# EAGLE design zx81_kbd v0.2 (EAGLE 9.6.2)
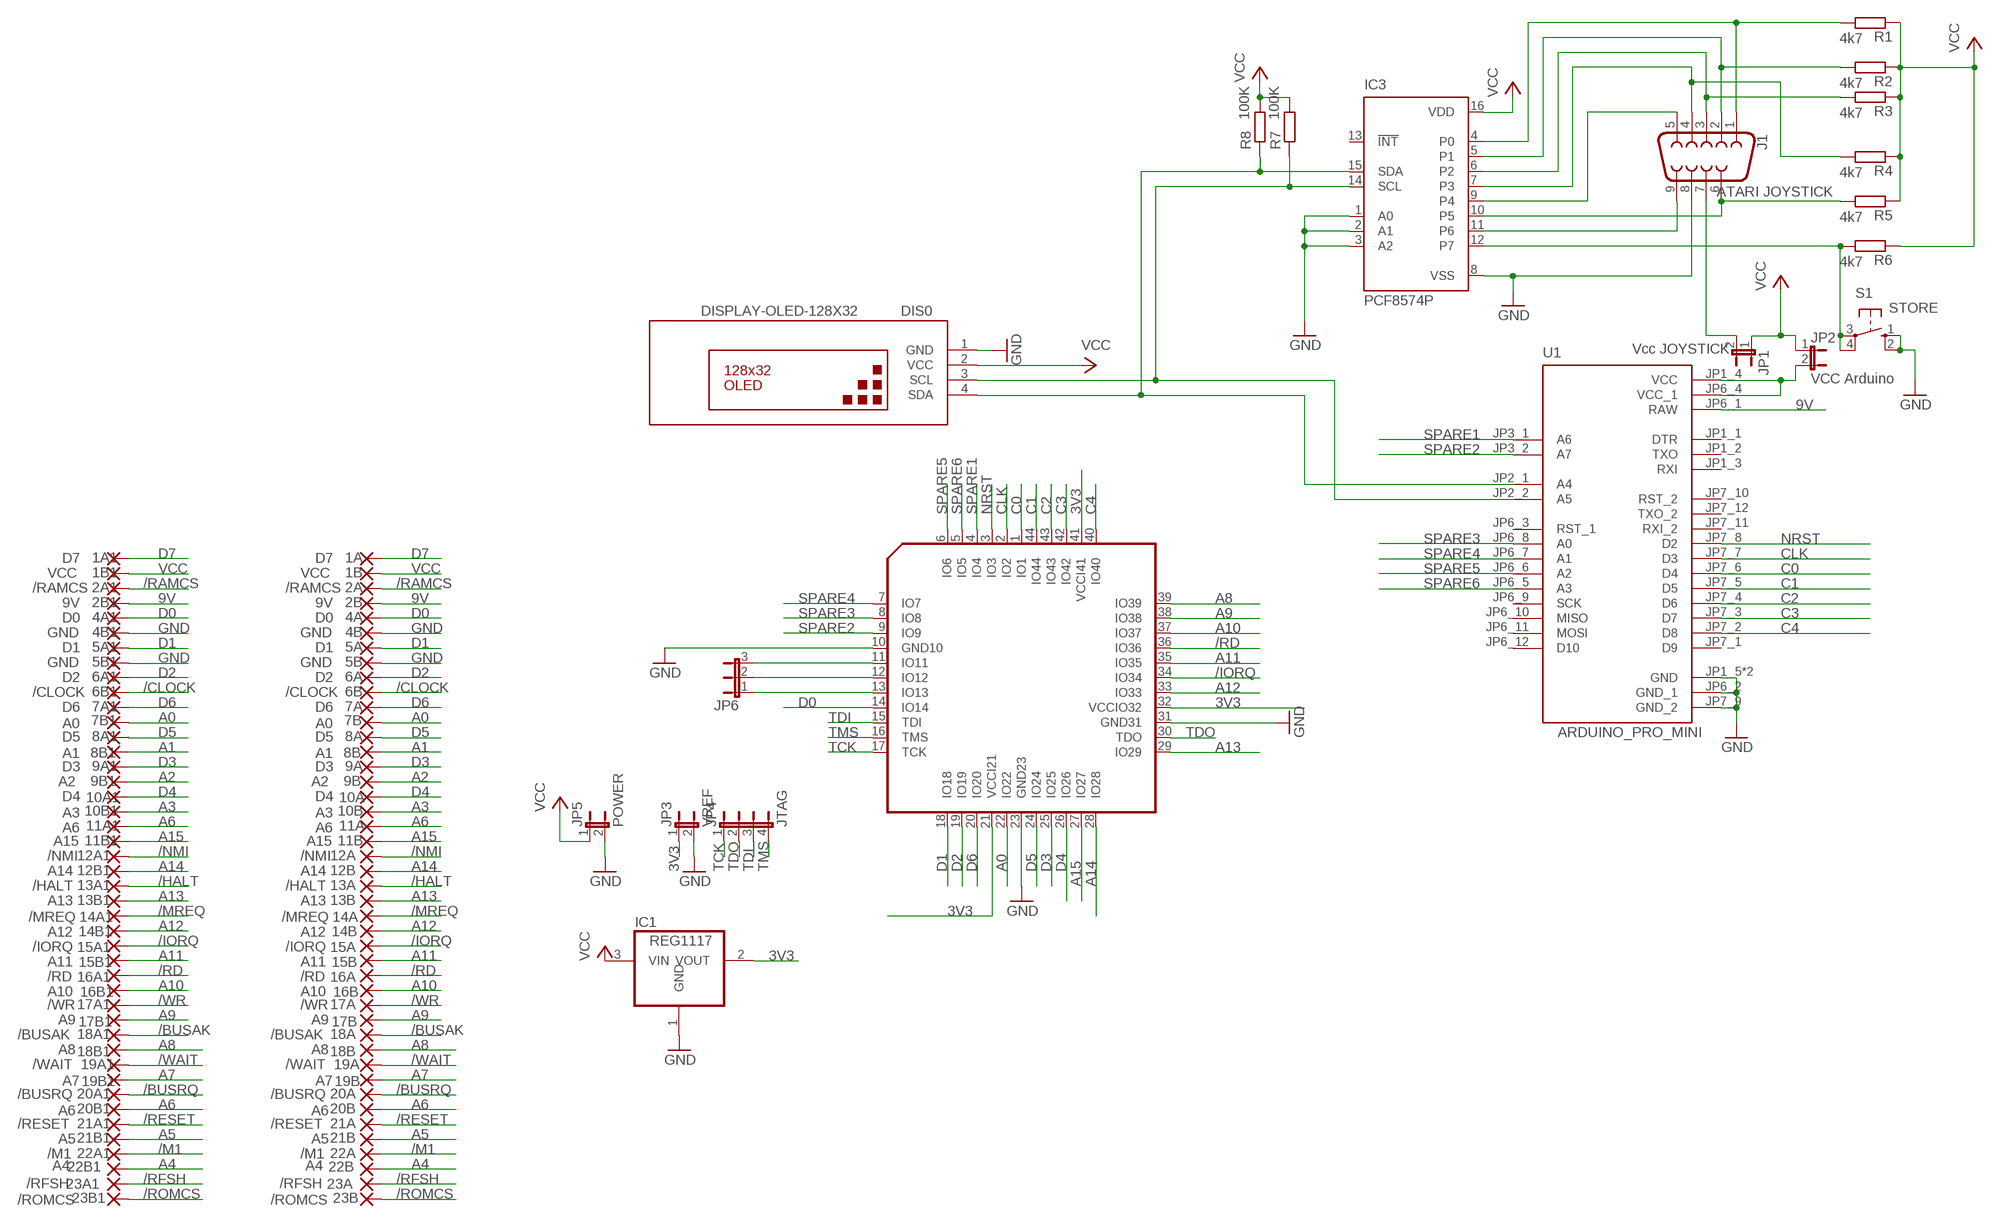
[diagram p0: schematic, sheet 1]

## Parts
1A  D7  SMD2EDGEPIN  [EDGEPIN]
1A1  D7  SMD2EDGEPIN  [EDGEPIN]
1B  VCC  SMD2EDGEPIN  [EDGEPIN]
1B1  VCC  SMD2EDGEPIN  [EDGEPIN]
2A  /RAMCS  SMD2EDGEPIN  [EDGEPIN]
2A1  /RAMCS  SMD2EDGEPIN  [EDGEPIN]
2B  9V  SMD2EDGEPIN  [EDGEPIN]
2B1  9V  SMD2EDGEPIN  [EDGEPIN]
4A  D0  SMD2EDGEPIN  [EDGEPIN]
4A1  D0  SMD2EDGEPIN  [EDGEPIN]
4B  GND  SMD2EDGEPIN  [EDGEPIN]
4B1  GND  SMD2EDGEPIN  [EDGEPIN]
5A  D1  SMD2EDGEPIN  [EDGEPIN]
5A1  D1  SMD2EDGEPIN  [EDGEPIN]
5B  GND  SMD2EDGEPIN  [EDGEPIN]
5B1  GND  SMD2EDGEPIN  [EDGEPIN]
6A  D2  SMD2EDGEPIN  [EDGEPIN]
6A1  D2  SMD2EDGEPIN  [EDGEPIN]
6B  /CLOCK  SMD2EDGEPIN  [EDGEPIN]
6B1  /CLOCK  SMD2EDGEPIN  [EDGEPIN]
7A  D6  SMD2EDGEPIN  [EDGEPIN]
7A1  D6  SMD2EDGEPIN  [EDGEPIN]
7B  A0  SMD2EDGEPIN  [EDGEPIN]
7B1  A0  SMD2EDGEPIN  [EDGEPIN]
8A  D5  SMD2EDGEPIN  [EDGEPIN]
8A1  D5  SMD2EDGEPIN  [EDGEPIN]
8B  A1  SMD2EDGEPIN  [EDGEPIN]
8B1  A1  SMD2EDGEPIN  [EDGEPIN]
9A  D3  SMD2EDGEPIN  [EDGEPIN]
9A1  D3  SMD2EDGEPIN  [EDGEPIN]
9B  A2  SMD2EDGEPIN  [EDGEPIN]
9B1  A2  SMD2EDGEPIN  [EDGEPIN]
10A  D4  SMD2EDGEPIN  [EDGEPIN]
10A1  D4  SMD2EDGEPIN  [EDGEPIN]
10B  A3  SMD2EDGEPIN  [EDGEPIN]
10B1  A3  SMD2EDGEPIN  [EDGEPIN]
11A  A6  SMD2EDGEPIN  [EDGEPIN]
11A1  A6  SMD2EDGEPIN  [EDGEPIN]
11B  A15  SMD2EDGEPIN  [EDGEPIN]
11B1  A15  SMD2EDGEPIN  [EDGEPIN]
12A  /NMI  SMD2EDGEPIN  [EDGEPIN]
12A1  /NMI  SMD2EDGEPIN  [EDGEPIN]
12B  A14  SMD2EDGEPIN  [EDGEPIN]
12B1  A14  SMD2EDGEPIN  [EDGEPIN]
13A  /HALT  SMD2EDGEPIN  [EDGEPIN]
13A1  /HALT  SMD2EDGEPIN  [EDGEPIN]
13B  A13  SMD2EDGEPIN  [EDGEPIN]
13B1  A13  SMD2EDGEPIN  [EDGEPIN]
14A  /MREQ  SMD2EDGEPIN  [EDGEPIN]
14A1  /MREQ  SMD2EDGEPIN  [EDGEPIN]
14B  A12  SMD2EDGEPIN  [EDGEPIN]
14B1  A12  SMD2EDGEPIN  [EDGEPIN]
15A  /IORQ  SMD2EDGEPIN  [EDGEPIN]
15A1  /IORQ  SMD2EDGEPIN  [EDGEPIN]
15B  A11  SMD2EDGEPIN  [EDGEPIN]
15B1  A11  SMD2EDGEPIN  [EDGEPIN]
16A  /RD  SMD2EDGEPIN  [EDGEPIN]
16A1  /RD  SMD2EDGEPIN  [EDGEPIN]
16B  A10  SMD2EDGEPIN  [EDGEPIN]
16B1  A10  SMD2EDGEPIN  [EDGEPIN]
17A  /WR  SMD2EDGEPIN  [EDGEPIN]
17A1  /WR  SMD2EDGEPIN  [EDGEPIN]
17B  A9  SMD2EDGEPIN  [EDGEPIN]
17B1  A9  SMD2EDGEPIN  [EDGEPIN]
18A  /BUSAK  SMD2EDGEPIN  [EDGEPIN]
18A1  /BUSAK  SMD2EDGEPIN  [EDGEPIN]
18B  A8  SMD2EDGEPIN  [EDGEPIN]
18B1  A8  SMD2EDGEPIN  [EDGEPIN]
19A  /WAIT  SMD2EDGEPIN  [EDGEPIN]
19A1  /WAIT  SMD2EDGEPIN  [EDGEPIN]
19B  A7  SMD2EDGEPIN  [EDGEPIN]
19B1  A7  SMD2EDGEPIN  [EDGEPIN]
20A  /BUSRQ  SMD2EDGEPIN  [EDGEPIN]
20A1  /BUSRQ  SMD2EDGEPIN  [EDGEPIN]
20B  A6  SMD2EDGEPIN  [EDGEPIN]
20B1  A6  SMD2EDGEPIN  [EDGEPIN]
21A  /RESET  SMD2EDGEPIN  [EDGEPIN]
21A1  /RESET  SMD2EDGEPIN  [EDGEPIN]
21B  A5  SMD2EDGEPIN  [EDGEPIN]
21B1  A5  SMD2EDGEPIN  [EDGEPIN]
22A  /M1  SMD2EDGEPIN  [EDGEPIN]
22A1  /M1  SMD2EDGEPIN  [EDGEPIN]
22B  A4  SMD2EDGEPIN  [EDGEPIN]
22B1  A4  SMD2EDGEPIN  [EDGEPIN]
23A  /RFSH  SMD2EDGEPIN  [EDGEPIN]
23A1  /RFSH  SMD2EDGEPIN  [EDGEPIN]
23B  /ROMCS  SMD2EDGEPIN  [EDGEPIN]
23B1  /ROMCS  SMD2EDGEPIN  [EDGEPIN]
DIS0  DISPLAY-OLED-128X32  [DISPLAY-OLED-128X32]
IC1  REG1117  [SOT223]
IC3  PCF8574P  [DIL16]
J1  ATARI JOYSTICK  DB9MALE  [DB9_MALE]
JP1  Vcc JOYSTICK  JP1E  [JP1]
JP2  VCC Arduino  JP1E  [JP1]
JP3  VREF  JP1E  [JP1]
JP4  JTAG  JP4E  [JP4]
JP5  POWER  JP1E  [JP1]
JP6  JP2E  [JP2]
R1  4k7  R-EU_0204/7  [0204/7]
R2  4k7  R-EU_0204/7  [0204/7]
R3  4k7  R-EU_0204/7  [0204/7]
R4  4k7  R-EU_0204/7  [0204/7]
R5  4k7  R-EU_0204/7  [0204/7]
R6  4k7  R-EU_0204/7  [0204/7]
R7  100K  R-EU_0204/7  [0204/7]
R8  100K  R-EU_0204/7  [0204/7]
S1  STORE  10-XX11MM  [B3F-10XX_11MM]
U1  ARDUINO_PRO_MINI  [MODULE_ARDUINO_PRO_MINI]
XC95CPLD  XC9572PLC  [3M44]

## Nets
3V3 [VCC]: IC1.2(VOUT) JP3.1 XC95CPLD.21(VCCI21) XC95CPLD.32(VCCIO32) XC95CPLD.41(VCCI41)
9V [VCC]: 2B1.1(P) 2B.1(P) U1.JP6_1(RAW)
/BUSAK: 18A1.1(P) 18A.1(P)
/BUSRQ: 20A1.1(P) 20A.1(P)
/CLOCK: 6B1.1(P) 6B.1(P)
/HALT: 13A1.1(P) 13A.1(P)
/IORQ: 15A1.1(P) 15A.1(P) XC95CPLD.34(IO34)
/M1: 22A1.1(P) 22A.1(P)
/MREQ: 14A1.1(P) 14A.1(P)
/NMI: 12A1.1(P) 12A.1(P)
/RAMCS: 2A1.1(P) 2A.1(P)
/RD: 16A1.1(P) 16A.1(P) XC95CPLD.36(IO36)
/RESET: 21A1.1(P) 21A.1(P)
/RFSH: 23A1.1(P) 23A.1(P)
/ROMCS: 23B1.1(P) 23B.1(P)
/WAIT: 19A1.1(P) 19A.1(P)
/WR: 17A1.1(P) 17A.1(P)
A0: 7B1.1(P) 7B.1(P) XC95CPLD.22(IO22)
A1: 8B1.1(P) 8B.1(P)
A2: 9B1.1(P) 9B.1(P)
A3: 10B1.1(P) 10B.1(P)
A4: 22B1.1(P) 22B.1(P)
A5: 21B1.1(P) 21B.1(P)
A6: 11A1.1(P) 11A.1(P) 20B1.1(P) 20B.1(P)
A7: 19B1.1(P) 19B.1(P)
A8: 18B1.1(P) 18B.1(P) XC95CPLD.39(IO39)
A9: 17B1.1(P) 17B.1(P) XC95CPLD.38(IO38)
A10: 16B1.1(P) 16B.1(P) XC95CPLD.37(IO37)
A11: 15B1.1(P) 15B.1(P) XC95CPLD.35(IO35)
A12: 14B1.1(P) 14B.1(P) XC95CPLD.33(IO33)
A13: 13B1.1(P) 13B.1(P) XC95CPLD.29(IO29)
A14: 12B1.1(P) 12B.1(P) XC95CPLD.28(IO28)
A15: 11B1.1(P) 11B.1(P) XC95CPLD.27(IO27)
C0: U1.JP7_6(D4) XC95CPLD.1(IO1)
C1: U1.JP7_5(D5) XC95CPLD.44(IO44)
C2: U1.JP7_4(D6) XC95CPLD.43(IO43)
C3: U1.JP7_3(D7) XC95CPLD.42(IO42)
C4: U1.JP7_2(D8) XC95CPLD.40(IO40)
CLK: U1.JP7_7(D3) XC95CPLD.2(IO2)
D0: 4A1.1(P) 4A.1(P) XC95CPLD.14(IO14)
D1: 5A1.1(P) 5A.1(P) XC95CPLD.18(IO18)
D2: 6A1.1(P) 6A.1(P) XC95CPLD.19(IO19)
D3: 9A1.1(P) 9A.1(P) XC95CPLD.25(IO25)
D4: 10A1.1(P) 10A.1(P) XC95CPLD.26(IO26)
D5: 8A1.1(P) 8A.1(P) XC95CPLD.24(IO24)
D6: 7A1.1(P) 7A.1(P) XC95CPLD.20(IO20)
D7: 1A1.1(P) 1A.1(P)
GND [VCC]: 4B1.1(P) 4B.1(P) 5B1.1(P) 5B.1(P) DIS0.1(GND) IC1.1(GND) IC3.1(A0) IC3.2(A1) IC3.3(A2) IC3.8(VSS) J1.8 JP3.2 JP5.2 S1.1(S) S1.2(S1) U1.JP1_5(GND) U1.JP1_6(GND) U1.JP6_2(GND_1) U1.JP7_9(GND_2) XC95CPLD.10(GND10) XC95CPLD.23(GND23) XC95CPLD.31(GND31)
N$1: JP6.3 XC95CPLD.11(IO11)
N$2: JP6.2 XC95CPLD.12(IO12)
N$3: JP6.1 XC95CPLD.13(IO13)
N$5 [VCC]: JP2.2 U1.JP1_4(VCC) U1.JP6_4(VCC_1)
N$20: DIS0.4(SDA) IC3.15(SDA) R8.1 U1.JP2_1(A4)
N$21: DIS0.3(SCL) IC3.14(SCL) R7.1 U1.JP2_2(A5)
N$29: IC3.4(P0) J1.1 R1.2
N$32: IC3.5(P1) J1.2 R2.2
N$33: IC3.6(P2) J1.3 R3.2
N$34: IC3.7(P3) J1.4 R4.2
N$35: IC3.10(P5) J1.6 R5.2
N$36: IC3.9(P4) J1.5
N$37: IC3.12(P7) R6.2 S1.3(P) S1.4(P1)
N$38: J1.7 JP1.2
N$39: IC3.11(P6) J1.9
NRST: U1.JP7_8(D2) XC95CPLD.3(IO3)
SPARE1: U1.JP3_1(A6) XC95CPLD.4(IO4)
SPARE2: U1.JP3_2(A7) XC95CPLD.9(IO9)
SPARE3: U1.JP6_8(A0) XC95CPLD.8(IO8)
SPARE4: U1.JP6_7(A1) XC95CPLD.7(IO7)
SPARE5: U1.JP6_6(A2) XC95CPLD.6(IO6)
SPARE6: U1.JP6_5(A3) XC95CPLD.5(IO5)
TCK: JP4.1 XC95CPLD.17(TCK)
TDI: JP4.3 XC95CPLD.15(TDI)
TDO: JP4.2 XC95CPLD.30(TDO)
TMS: JP4.4 XC95CPLD.16(TMS)
VCC [VCC]: 1B1.1(P) 1B.1(P) DIS0.2(VCC) IC1.3(VIN) IC3.16(VDD) JP1.1 JP2.1 JP5.1 R1.1 R2.1 R3.1 R4.1 R5.1 R6.1 R7.2 R8.2
Unconnected: IC3.13(!INT) U1.JP1_1(DTR) U1.JP1_2(TXO) U1.JP1_3(RXI) U1.JP6_3(RST_1) U1.JP6_9(SCK) U1.JP6_10(MISO) U1.JP6_11(MOSI) U1.JP6_12(D10) U1.JP7_1(D9) U1.JP7_10(RST_2) U1.JP7_11(RXI_2) U1.JP7_12(TXO_2)

## Library data of the parts
1A 1A1 1B 1B1 2A 2A1 2B 2B1 4A 4A1 4B 4B1 5A 5A1 5B 5B1 6A 6A1 6B 6B1 7A 7A1 7B 7B1 8A 8A1 8B 8B1 9A 9A1 9B 9B1 10A 10A1 10B 10B1 11A 11A1 11B 11B1 12A 12A1 12B 12B1 13A 13A1 13B 13B1 14A 14A1 14B 14B1 15A 15A1 15B 15B1 16A 16A1 16B 16B1 17A 17A1 17B 17B1 18A 18A1 18B 18B1 19A 19A1 19B 19B1 20A 20A1 20B 20B1 21A 21A1 21B 21B1 22A 22A1 22B 22B1 23A 23A1 23B 23B1 = wirepad:SMD2: SMD PAD
DIS0 = diy-modules:DISPLAY-OLED-128X32: 128x32 Dot Matrix OLED Module with I2C interface based on SSD1306 chip More details available here: http://www.tinyosshop.com/index.php?route=product/product&product_id=953 Schematic available here: http://www.tinyosshop.com/datasheet/OLED%2012832.pdf SSD1306 datasheet: https://cdn-shop.adafruit.com/datasheets/SSD1306.pdf Click here to find device on ebay.com <http://www.ebay.com/sch/oled+display+128x32+i2c>
IC1 = burr-brown:REG1117: 800mA and 1A Low Dropout (LDO) Positive Regulator 1.8V, 2.5V, 2.85V, 3.3V, 5V, and Adj; MPN: REG1117
IC3 = micro-philips:PCF8574: I2C-Bus Remote 8-bit I/O expander http://www.semiconductors.philips.com/acrobat_download/datasheets/PCF8574_4.pdf; MPN: PCF8574PN; OC_FARNELL: 204020; OC_NEWARK: 11N8515
J1 = SparkFun-Connectors:DB9: DB9 Connector Standard DB9 (D-Sub 9) serial connector. Can be used for CAN bus as well as RS485 and RS232. Footprint production proven. Here is the female version connector we sell at SparkFun: 9 Pin Female Serial Connector - PCB Mount <https://www.sparkfun.com/products/429> (PRT-00429) This connector has been used on the following SparkFun products: SparkFun RS232 Shifter - SMD <https://www.sparkfun.com/products/449> (PRT-00449) SparkFun RS232 Shifter SMD (No DB9) <https://www.sparkfun.com/products/8780> (PRT-08780); PROD_ID: CONN-09904
JP1-JP3 JP5 = jumper:JP1E: JUMPER
JP4 = jumper:JP4E: JUMPER
JP6 = jumper:JP2E: JUMPER
R1-R8 = rcl:R-EU_: RESISTOR, European symbol; SPICEPREFIX: R
S1 = switch-omron:10-XX: OMRON SWITCH
U1 = ARDUINO_PRO_MINI:ARDUINO_PRO_MINI: ATmega328 Arduino Pro Mini 328 5V/16MHz AVR® ATmega AVR MCU 8-Bit Embedded Evaluation Board Check availability <https://pricing.snapeda.com/parts/Arduino%20Pro%20Mini/Arduino/view-part?ref=eda>; AVAILABILITY: In Stock; CHECK_PRICES: https://www.snapeda.com/parts/Arduino%20Pro%20Mini/Arduino/view-part/?ref=eda; DESCRIPTION: This board was developed for applications and installations where space is premium and projects are made as permanent set ups. Small, available in 3.3 V and 5 V versions, powered by ATmega328P.; MF: Arduino; MP: Arduino Pro Mini; PACKAGE: None; PRICE: None; SNAPEDA_LINK: https://www.snapeda.com/parts/Arduino%20Pro%20Mini/Arduino/view-part/?ref=snap
XC95CPLD = xilinx_9:XC9572PLC

## Net classes
0 default: width 0.254 mm, drill 0.2 mm, clearance 0.127 mm
1 VCC: width 0.4 mm

## Board
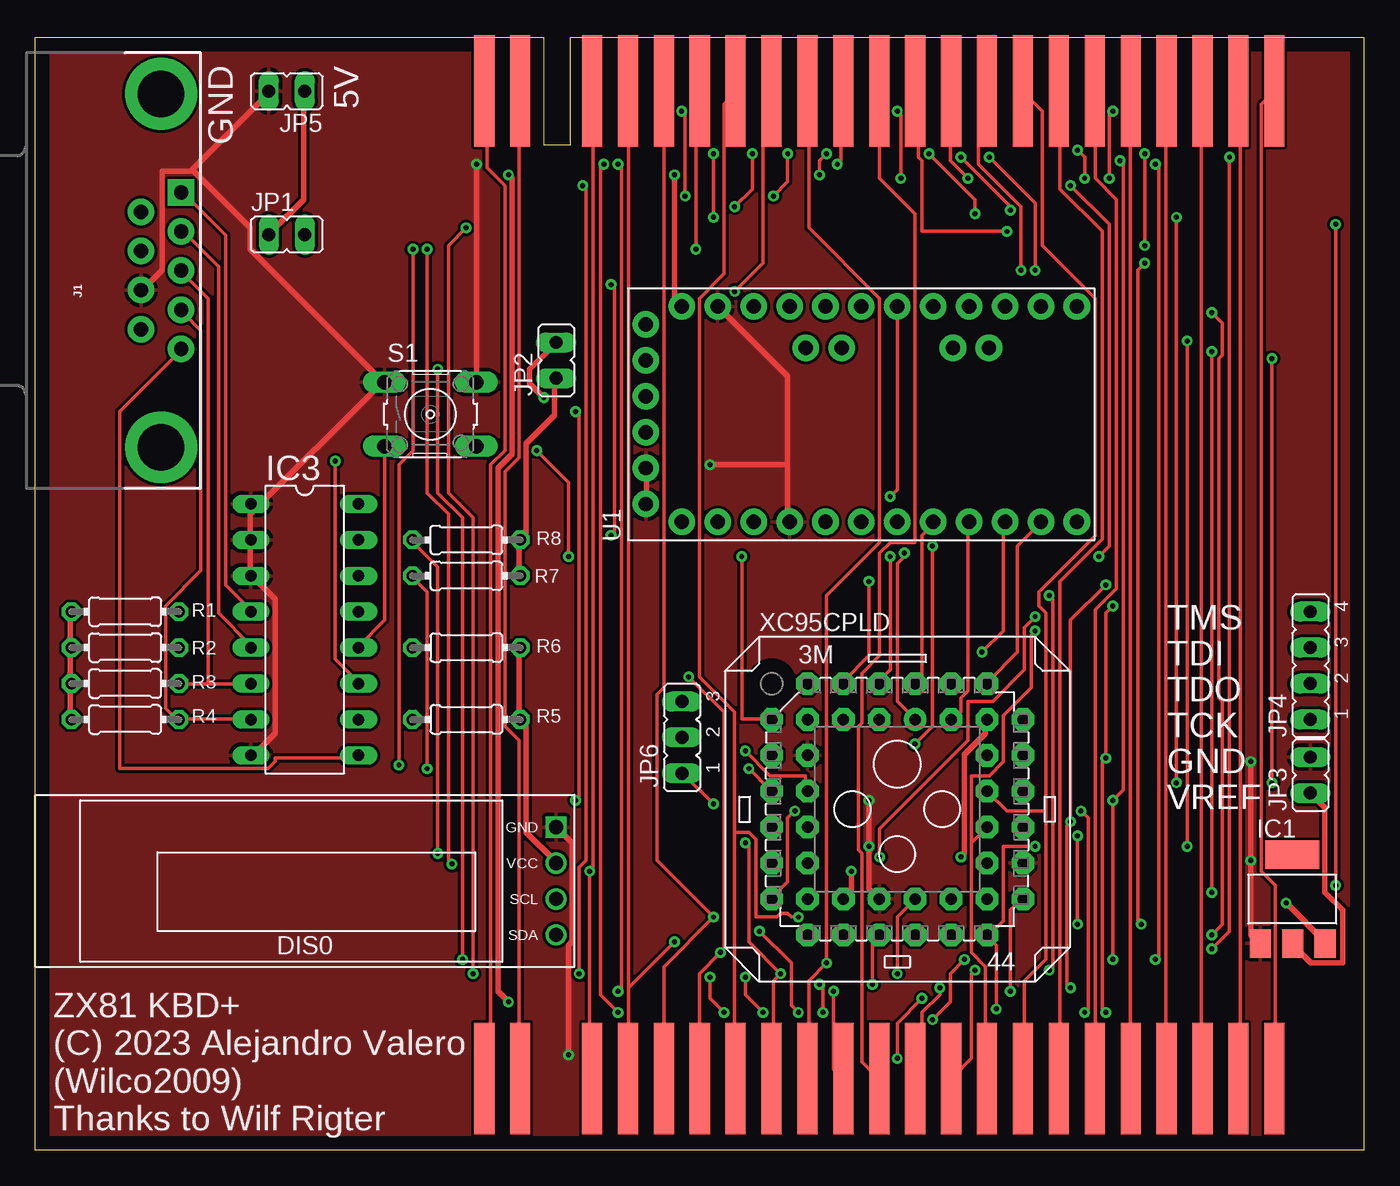
[diagram p1: board, top side]
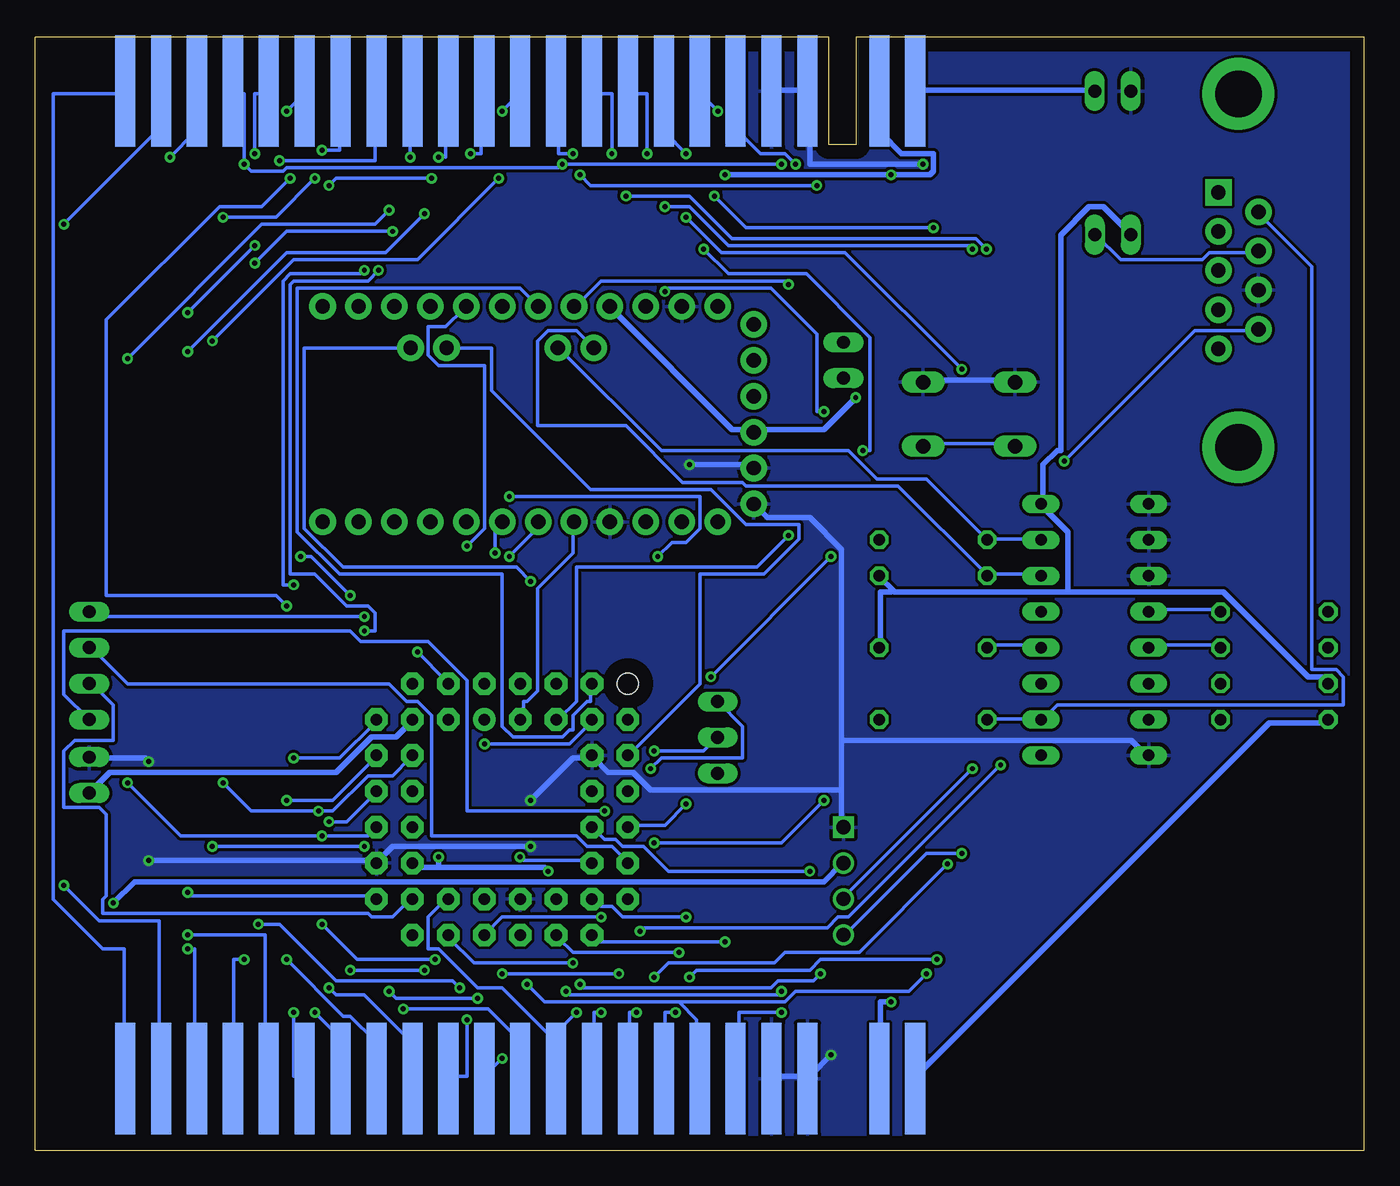
[diagram p2: board, bottom side, seen from below]

Size 93.98 x 78.74 mm. Coordinates in mm from the lower left corner, seen from the top.
Outline: 93.98,0 93.98,78.74 37.85,78.74 37.85,71.12 35.94,71.12 35.94,78.74 0,78.74 0,0 93.98,0
Copper layers (1*16): Top 0.035mm / dielectric 1.5mm / Bottom 0.035mm
Design rules "default": minimum track width 6mil, minimum drill 0.35mm, track to track 6mil, track to pad 6mil, pad to pad 6mil, via to via 6mil, smd to smd 6mil, copper to edge 40mil, drill to drill 6mil, minimum pad ring 10mil, minimum via ring 8mil, stop-mask expansion 4mil, vias tented up to drill 0mil, thermal gap 10mil

### Footprints (pad centres in the part's own frame; a part is rotated, then mirrored left to right if it is on the bottom)
EDGEPIN = smd 1.422 x 7.874: 1 0,0
DISPLAY-OLED-128X32 = drill 1 square: 1 -17.78,-3.81 | drill 1: 2 -17.78,-1.27; 3 -17.78,1.27; 4 -17.78,3.81
SOT223 = smd 1.499 x 2.007: 1 -2.261,-3.15; 2 0.025,-3.15; 3 2.311,-3.15 | smd 3.81 x 2.007: 4 0,3.15
DIL16 = drill 0.813 long: 1 -8.89,-3.81; 2 -6.35,-3.81; 3 -3.81,-3.81; 4 -1.27,-3.81; 5 1.27,-3.81; 6 3.81,-3.81; 7 6.35,-3.81; 8 8.89,-3.81; 9 8.89,3.81; 10 6.35,3.81; 11 3.81,3.81; 12 1.27,3.81; 13 -1.27,3.81; 14 -3.81,3.81; 15 -6.35,3.81; 16 -8.89,3.81
DB9_MALE = drill 1.016 pad 1.88 square: 1 5.54,-1.42 | drill 1.016 pad 1.88: 2 2.77,-1.42; 3 0,-1.42; 4 -2.77,-1.42; 5 -5.54,-1.42; 6 4.15,1.42; 7 1.38,1.42; 8 -1.38,1.42; 9 -4.15,1.42 | drill 3.302 pad 5.08: G1 -12.5,0; G2 12.5,0
JP1 = drill 0.914 long: 1 0,-1.27; 2 0,1.27
JP4 = drill 0.914 long: 1 -3.81,0; 2 -1.27,0; 3 1.27,0; 4 3.81,0
JP2 = drill 0.914 long: 1 -2.54,0; 2 0,0; 3 2.54,0
0204/7 = drill 0.813 octagon: 1 -3.81,0; 2 3.81,0
B3F-10XX_11MM = drill 1.016 long: 1 -3.251,2.261; 2 3.251,2.261; 3 -3.251,-2.261; 4 3.251,-2.261
MODULE_ARDUINO_PRO_MINI = drill 1.016 pad 1.88: JP1_1 6.35,15.24; JP1_2 3.81,15.24; JP1_3 1.27,15.24; JP1_4 -1.27,15.24; JP1_5 -3.81,15.24; JP1_6 -6.35,15.24; JP2_1 4.699,1.397; JP2_2 4.699,3.937; JP3_1 4.699,-9.017; JP3_2 4.699,-6.477; JP6_1 7.62,12.7; JP6_2 7.62,10.16; JP6_3 7.62,7.62; JP6_4 7.62,5.08; JP6_5 7.62,2.54; JP6_6 7.62,0; JP6_7 7.62,-2.54; JP6_8 7.62,-5.08; JP6_9 7.62,-7.62; JP6_10 7.62,-10.16; JP6_11 7.62,-12.7; JP6_12 7.62,-15.24; JP7_1 -7.62,-15.24; JP7_2 -7.62,-12.7; JP7_3 -7.62,-10.16; JP7_4 -7.62,-7.62; JP7_5 -7.62,-5.08; JP7_6 -7.62,-2.54; JP7_7 -7.62,0; JP7_8 -7.62,2.54; JP7_9 -7.62,5.08; JP7_10 -7.62,7.62; JP7_11 -7.62,10.16; JP7_12 -7.62,12.7
3M44 = drill 0.813 pad 1.6: 1 1.27,6.35 | drill 0.813 pad 1.6 octagon: 2 -1.27,8.89; 3 -1.27,6.35; 4 -3.81,8.89; 5 -3.81,6.35; 6 -6.35,8.89; 7 -8.89,6.35; 8 -6.35,6.35; 9 -8.89,3.81; 10 -6.35,3.81; 11 -8.89,1.27; 12 -6.35,1.27; 13 -8.89,-1.27; 14 -6.35,-1.27; 15 -8.89,-3.81; 16 -6.35,-3.81; 17 -8.89,-6.35; 18 -6.35,-8.89; 19 -6.35,-6.35; 20 -3.81,-8.89; 21 -3.81,-6.35; 22 -1.27,-8.89; 23 -1.27,-6.35; 24 1.27,-8.89; 25 1.27,-6.35; 26 3.81,-8.89; 27 3.81,-6.35; 28 6.35,-8.89; 29 8.89,-6.35; 30 6.35,-6.35; 31 8.89,-3.81; 32 6.35,-3.81; 33 8.89,-1.27; 34 6.35,-1.27; 35 8.89,1.27; 36 6.35,1.27; 37 8.89,3.81; 38 6.35,3.81; 39 8.89,6.35; 40 6.35,8.89; 41 6.35,6.35; 42 3.81,8.89; 43 3.81,6.35; 44 1.27,8.89 | hole 1.499: -8.89,8.89

### Placement (x,y rotation side)
1A  31.75,5.08 0 top
1A1  31.75,74.93 0 top
1B  31.75,5.08 0 bottom
1B1  31.75,74.93 0 bottom
2A  34.29,5.08 0 top
2A1  34.29,74.93 0 top
2B  34.29,5.08 0 bottom
2B1  34.29,74.93 0 bottom
4A  39.37,5.08 0 top
4A1  39.37,74.93 0 top
4B  39.37,5.08 0 bottom
4B1  39.37,74.93 0 bottom
5A  41.91,5.08 0 top
5A1  41.91,74.93 0 top
5B  41.91,5.08 0 bottom
5B1  41.91,74.93 0 bottom
6A  44.45,5.08 0 top
6A1  44.45,74.93 0 top
6B  44.45,5.08 0 bottom
6B1  44.45,74.93 0 bottom
7A  46.99,5.08 0 top
7A1  46.99,74.93 0 top
7B  46.99,5.08 0 bottom
7B1  46.99,74.93 0 bottom
8A  49.53,5.08 0 top
8A1  49.53,74.93 0 top
8B  49.53,5.08 0 bottom
8B1  49.53,74.93 0 bottom
9A  52.07,5.08 0 top
9A1  52.07,74.93 0 top
9B  52.07,5.08 0 bottom
9B1  52.07,74.93 0 bottom
10A  54.61,5.08 0 top
10A1  54.61,74.93 0 top
10B  54.61,5.08 0 bottom
10B1  54.61,74.93 0 bottom
11A  57.15,5.08 0 top
11A1  57.15,74.93 0 top
11B  57.15,5.08 0 bottom
11B1  57.15,74.93 0 bottom
12A  59.69,5.08 0 top
12A1  59.69,74.93 0 top
12B  59.69,5.08 0 bottom
12B1  59.69,74.93 0 bottom
13A  62.23,5.08 0 top
13A1  62.23,74.93 0 top
13B  62.23,5.08 0 bottom
13B1  62.23,74.93 0 bottom
14A  64.77,5.08 0 top
14A1  64.77,74.93 0 top
14B  64.77,5.08 0 bottom
14B1  64.77,74.93 0 bottom
15A  67.31,5.08 0 top
15A1  67.31,74.93 0 top
15B  67.31,5.08 0 bottom
15B1  67.31,74.93 0 bottom
16A  69.85,5.08 0 top
16A1  69.85,74.93 0 top
16B  69.85,5.08 0 bottom
16B1  69.85,74.93 0 bottom
17A  72.39,5.08 0 top
17A1  72.39,74.93 0 top
17B  72.39,5.08 0 bottom
17B1  72.39,74.93 0 bottom
18A  74.93,5.08 0 top
18A1  74.93,74.93 0 top
18B  74.93,5.08 0 bottom
18B1  74.93,74.93 0 bottom
19A  77.47,5.08 0 top
19A1  77.47,74.93 0 top
19B  77.47,5.08 0 bottom
19B1  77.47,74.93 0 bottom
20A  80.01,5.08 0 top
20A1  80.01,74.93 0 top
20B  80.01,5.08 0 bottom
20B1  80.01,74.93 0 bottom
21A  82.55,5.08 0 top
21A1  82.55,74.93 0 top
21B  82.55,5.08 0 bottom
21B1  82.55,74.93 0 bottom
22A  85.09,5.08 0 top
22A1  85.09,74.93 0 top
22B  85.09,5.08 0 bottom
22B1  85.09,74.93 0 bottom
23A  87.63,5.08 0 top
23A1  87.63,74.93 0 top
23B  87.63,5.08 0 bottom
23B1  87.63,74.93 0 bottom
DIS0  19.05,19.05 180 top
IC1  88.9,17.78 0 top
IC3  19.05,36.83 270 top
J1  8.89,62.23 90 top
JP1  17.78,64.77 270 top
JP2  36.83,55.88 0 top
JP3  90.17,26.54 0 top
JP4  90.17,34.29 90 top
JP5  17.78,74.93 90 top
JP6  45.72,29.21 90 top
R1  6.35,38.1 0 top
R2  6.35,35.56 0 top
R3  6.35,33.02 0 top
R4  6.35,30.48 0 top
R5  30.48,30.48 180 top
R6  30.48,35.56 180 top
R7  30.48,40.64 0 top
R8  30.48,43.18 0 top
S1  27.94,52.07 0 top
U1  58.42,52.07 90 top
XC95CPLD  60.96,24.13 0 top

### Tracks (layer width: path | path; a pad name or v marks a point on that pad's centre or on a via)
3V3  (via drill 0.35)
  Top 0.4: v57.71,19.75 57.71,18.5 57.21,18 XC95CPLD.21 | IC1.2 88.96,14.5 90.21,13.25 92.46,13.25 92.46,17 91.21,18.25 91.21,24.25 90.21,25.25 JP3.1 | v65.46,20.75 65.71,21 65.71,28 67.21,29.5 67.21,30.25 XC95CPLD.41
  Bottom 0.4: v57.71,19.75 57.96,20 65.46,20 | 65.46,20 66.96,20 67.21,20.25 XC95CPLD.32 | XC95CPLD.41 67.46,30.25 68.46,29.25 70.21,29.25 72.71,26.75 88.71,26.75 89.96,25.5 JP3.1 | v65.46,20.75 65.46,20
9V  (via drill 0.35)
  Top 0.4: v45.21,69 45.21,60.25 45.71,59.75 U1.JP6_1 | v33.46,10.5 32.71,11.25 32.71,48.25 33.71,49.25 33.71,68.75 v33.46,69
  Bottom 0.4: v45.21,69 v33.46,69 30.71,69 30.46,69.25 30.46,70.5 32.71,70.5 34.21,72 34.21,74.75 2B1.1 | v33.46,10.5 34.21,10.5 34.21,5.25 2B.1
/BUSAK
  Top 0.254: 18A.1 74.96,5.25 74.96,38.25 76.46,39.75 76.46,67.25 74.96,68.75 74.96,74.75 18A1.1
/BUSRQ
  Top 0.254: 20A.1 79.96,5.25 79.96,74.75 20A1.1
/CLOCK  (via drill 0.35)
  Top 0.254: v41.21,9.75 39.96,11 39.96,69.5 v40.21,69.75
  Bottom 0.254: v41.21,9.75 44.21,9.75 44.21,5.25 6B.1 | v40.21,69.75 40.96,70.5 42.71,70.5 44.21,72 44.21,74.75 6B1.1
/HALT  (via drill 0.35)
  Top 0.254: v63.96,11.5 63.96,11 62.71,9.75 62.71,5.5 62.46,5.25 13A.1 | v78.21,16 77.96,16.25 77.96,62.25 v78.46,62.75 | v68.71,65 62.71,65 62.71,70 62.46,70.25 62.46,74.75 13A1.1
  Bottom 0.254: v63.96,11.5 64.46,12 72.71,12 76.71,16 v78.21,16 | v78.46,62.75 76.21,65 v68.71,65
/IORQ  (via drill 0.35)
  Top 0.254: 66.21,21.75 67.21,22.75 XC95CPLD.34 | 66.21,21.75 66.21,14 67.21,13 67.21,5.25 15A.1 | v69.71,62.25 69.71,66.75 66.71,69.75 66.71,74.25 67.21,74.75 15A1.1 | v70.71,36.75 70.46,36.5 70.46,32.75 68.46,30.75 68.46,27.5 67.46,26.5 66.21,26.5 66.21,21.75
  Bottom 0.254: v69.71,62.25 70.46,61.5 75.71,61.5 75.96,61.25 75.96,40.75 74.21,40.75 71.96,38.5 70.46,38.5 69.96,38 69.96,36.75 v70.71,36.75
/M1
  Top 0.254: 22A.1 85.21,5.25 85.21,74.75 22A1.1
/MREQ  (via drill 0.35)
  Top 0.254: v66.46,12.75 66.21,12.5 66.21,6.5 64.96,5.25 14A.1 | v71.71,12.75 71.96,13 71.96,39 v71.71,39.25 | v75.21,42 75.96,42.75 75.96,65.5 v73.21,68.25 | v65.96,68.75 64.71,70 64.71,74.75 14A1.1
  Bottom 0.254: v71.71,12.75 v66.46,12.75 | v71.71,39.25 74.46,42 v75.21,42 | v73.21,68.25 72.71,68.75 v65.96,68.75
/NMI
  Top 0.254: 12A.1 59.46,5.25 58.46,6.25 58.46,21 58.21,21.25 58.21,30 58.46,30.25 58.46,33.75 59.71,35 59.71,42.25 60.46,43 62.21,43 62.21,66.25 59.71,68.75 59.71,74.75 12A1.1
/RAMCS
  Top 0.254: 2A.1 34.21,5.25 34.21,29 33.21,30 33.21,48 34.21,49 34.21,74.75 2A1.1
/RD
  Top 0.254: XC95CPLD.36 68.71,24 71.46,24 | 71.46,24 71.46,13.5 69.96,12 69.96,5.25 16A.1 | 71.46,24 71.46,38 70.96,38.5 70.96,39.5 74.96,43.5 74.96,60.25 71.21,64 71.21,73.5 69.96,74.75 16A1.1
/RESET
  Top 0.254: 21A.1 82.46,5.25 82.46,74.75 21A1.1
/RFSH
  Top 0.254: 23A.1 87.71,5.25 87.71,18.75 86.71,19.75 86.71,74 87.46,74.75 23A1.1
/ROMCS
  Bottom 0.254: 23B.1 87.71,5.25 87.71,14.25 89.21,14.25 92.71,17.75 92.71,74.75 87.71,74.75 23B1.1
/WAIT
  Top 0.254: 19A.1 77.46,5.25 77.46,74.75 19A1.1
/WR
  Top 0.254: 17A.1 72.46,5.25 72.46,40.25 75.46,43.25 75.46,65 72.46,68 72.46,74.75 17A1.1
A0  (via drill 0.35)
  Top 0.254: v59.21,11.75 59.21,14.75 59.46,15 XC95CPLD.22 | v45.71,73.5 45.96,73.25 v45.96,67.5 | v30.46,65.25 29.21,64 29.21,46.5 30.96,44.75 v30.96,12.5
  Bottom 0.254: v59.21,11.75 57.96,10.5 48.46,10.5 | 48.46,10.5 47.21,9.25 47.21,5.25 7B.1 | v45.71,73.5 46.96,74.75 7B1.1 | v45.96,67.5 43.71,65.25 v30.46,65.25 | v30.96,12.5 32.21,11.25 40.21,11.25 40.96,10.5 48.46,10.5
A1  (via drill 0.35)
  Top 0.254: v48.71,9.75 47.71,10.75 v47.71,12.25 | v30.21,13.5 30.21,44.75 28.46,46.5 v28.46,55.25 | v47.96,70.5 v47.96,66
  Bottom 0.254: v48.71,9.75 49.46,9.75 49.46,5.25 8B.1 | v47.71,12.25 47.21,12.75 39.21,12.75 38.46,13.5 v30.21,13.5 | v28.46,55.25 36.71,63.5 45.46,63.5 v47.96,66 | v47.96,70.5 49.46,72 49.46,74.75 8B1.1
A2  (via drill 0.35)
  Top 0.254: v51.46,9.75 50.21,11 v50.21,12.25 | v29.46,20.25 29.21,20.5 29.21,45 27.71,46.5 v27.71,63.75 | v49.46,66.75 50.71,68 v50.71,70.5
  Bottom 0.254: v51.46,9.75 51.96,9.75 51.96,5.25 9B.1 | v50.21,12.25 49.21,13.25 41.71,13.25 40.96,14 35.71,14 v29.46,20.25 | v27.71,63.75 27.96,64 44.96,64 47.71,66.75 v49.46,66.75 | v50.71,70.5 50.71,74.75 51.96,74.75 9B1.1
A3  (via drill 0.35)
  Top 0.254: v53.96,9.75 53.46,10.25 53.46,13.25 v51.21,15.5 | v25.71,27.25 25.71,48.5 26.71,49.5 v26.71,63.75 | v52.21,67.5 53.21,68.5 v53.21,70.5
  Bottom 0.254: v53.96,9.75 54.46,9.75 54.46,5.25 10B.1 | v51.21,15.5 50.96,15.75 37.96,15.75 37.21,16.5 36.46,16.5 v25.71,27.25 | v26.71,63.75 27.46,64.5 44.71,64.5 47.71,67.5 v52.21,67.5 | v53.21,70.5 53.21,74.75 54.46,74.75 10B1.1
A4  (via drill 0.35)
  Top 0.254: v91.96,65.5 v91.96,18.75
  Bottom 0.254: v91.96,18.75 89.46,16.25 85.21,16.25 85.21,5.25 22B.1 | v91.96,65.5 85.21,72.25 85.21,74.75 22B1.1
A5  (via drill 0.35)
  Top 0.254: v83.21,14.25 84.46,15.5 v84.46,70.25
  Bottom 0.254: v83.21,14.25 82.71,14.25 82.71,5.25 21B.1 | v84.46,70.25 82.71,72 82.71,74.75 21B1.1
A6  (via drill 0.35)
  Top 0.254: v79.21,13.5 79.46,13.75 79.46,69.5 v79.21,69.75 | v56.46,11.25 56.46,5.75 56.96,5.25 11A.1 | v41.21,11.25 41.46,11.5 41.46,69.5 v41.21,69.75 | v56.71,69.75 56.96,70 56.96,74.75 11A1.1
  Bottom 0.254: v79.21,13.5 79.96,13.5 79.96,5.25 20B.1 | 20B1.1 79.96,74.75 79.21,74.75 v79.21,69.75 78.71,69.25 76.46,69.25 76.21,69.5 56.96,69.5 v56.71,69.75 v41.21,69.75 | v56.46,11.25 56.21,11 41.46,11 v41.21,11.25
A7  (via drill 0.35)
  Top 0.254: v83.21,15.25 83.96,16 83.96,31.75 83.71,32 83.71,56 83.96,56.25 83.96,58.5 v83.21,59.25 | v78.46,70.5 v78.46,64
  Bottom 0.254: v83.21,15.25 77.71,15.25 77.71,5.25 19B.1 | v78.46,64 v83.21,59.25 | v78.46,70.5 78.46,74.75 77.71,74.75 19B1.1
A8  (via drill 0.35)
  Top 0.254: v75.71,9.75 75.46,10 75.46,27.5 v75.71,27.75 75.71,38 v76.21,38.5 | v76.21,73.5 75.96,73.25 v75.96,68.75
  Bottom 0.254: v75.71,27.75 72.46,27.75 69.96,30.25 XC95CPLD.39 | v75.71,9.75 75.71,5.25 74.96,5.25 18B.1 | v76.21,73.5 74.96,74.75 18B1.1 | v75.96,68.75 77.96,66.75 80.96,66.75 88.96,58.75 88.96,39.25 76.96,39.25 v76.21,38.5
A9  (via drill 0.35)
  Top 0.254: v73.96,24 74.46,23.5 74.46,10 v74.21,9.75 | v73.71,70.75 74.21,70.25 v74.21,68.75 | v80.71,26 v80.71,66
  Bottom 0.254: v74.21,9.75 72.46,8 72.46,5.25 17B.1 | XC95CPLD.38 67.46,27.75 68.71,26.5 70.46,26.5 72.96,24 v73.96,24 78.71,24 v80.71,26 | v73.71,70.75 72.46,70.75 72.46,74.75 17B1.1 | v74.21,68.75 76.96,66 v80.71,66
A10  (via drill 0.35)
  Top 0.254: v76.21,13.5 v76.21,24.75 76.96,25.5 76.96,69.75 v76.71,70
  Bottom 0.254: v76.21,24.75 72.96,24.75 69.96,27.75 XC95CPLD.37 | v76.21,13.5 72.21,9.5 71.71,9.5 69.96,7.75 69.96,5.25 16B.1 | v76.71,70 69.96,70 69.96,74.75 16B1.1
A11  (via drill 0.35)
  Top 0.254: v73.21,11.5 72.96,11.75 72.96,23 v73.21,23.25 73.21,37.5 v75.71,40 | v67.46,70.25 70.71,67 v70.71,62.25
  Bottom 0.254: v73.21,23.25 71.96,23.25 69.96,25.25 XC95CPLD.35 | v73.21,11.5 72.71,11 70.71,11 67.46,7.75 67.46,5.25 15B.1 | v67.46,70.25 67.46,74.75 15B1.1 | v70.71,62.25 70.96,62 75.96,62 76.46,61.5 76.46,40 v75.71,40
A12  (via drill 0.35)
  Top 0.254: v73.71,16 v73.71,22.25 | v65.71,13.5 64.71,12.5 64.71,10.5 v63.46,9.25 | v65.46,70.25 68.96,66.75 v68.96,66.5 | v87.46,26 v87.46,56
  Bottom 0.254: XC95CPLD.33 70.46,22.25 v73.71,22.25 83.71,22.25 v87.46,26 | v73.71,16 71.21,13.5 v65.71,13.5 | v63.46,9.25 63.46,5.25 64.71,5.25 14B.1 | v65.46,70.25 64.96,70.25 64.96,74.75 14B1.1 | v68.96,66.5 69.96,65.5 77.96,65.5 v87.46,56
A13  (via drill 0.35)
  Top 0.254: v68.96,11.25 68.96,17 69.71,17.75 XC95CPLD.29 | v62.71,10.75 60.96,9 v60.96,6.5 | v63.21,70.5 66.46,67.25 v66.46,66.25 | v83.21,18.25 v83.21,56.5
  Bottom 0.254: v68.96,11.25 68.46,10.75 v62.71,10.75 | v60.96,6.5 62.21,5.25 13B.1 | v63.21,70.5 62.46,70.5 62.46,74.75 13B1.1 | v66.46,66.25 69.21,63.5 76.21,63.5 v83.21,56.5 | v83.21,18.25 82.96,18 69.96,18 XC95CPLD.29
A14  (via drill 0.35)
  Top 0.254: v67.96,10 67.96,14.5 67.46,15 XC95CPLD.28 67.46,15.25 68.46,16.25 68.46,21.5 v70.71,21.5 | v60.96,73.5 61.21,73.25 v61.21,68.75 | v81.46,21.5 v81.46,57.25
  Bottom 0.254: v67.96,10 61.96,10 59.71,7.75 59.71,5.25 12B.1 | v60.96,73.5 59.71,74.75 12B1.1 | v61.21,68.75 66.96,63 75.71,63 v81.46,57.25 | v70.71,21.5 v81.46,21.5
A15  (via drill 0.35)
  Top 0.254: v55.96,70.5 55.46,70 v55.46,69 | v38.71,68.25 38.96,68 38.96,20.5 38.46,20 v38.46,12.5 | v55.46,11.75 55.71,11.5 v55.71,9.75
  Bottom 0.254: 57.46,8 57.21,7.75 57.21,5.25 11B.1 57.46,8 | 57.46,8 60.96,11.5 62.71,11.5 65.46,14.25 66.21,14.25 66.21,16.5 64.96,17.75 XC95CPLD.27 | v55.96,70.5 56.96,70.5 56.96,74.75 11B1.1 | v55.46,69 54.71,68.25 v38.71,68.25 | v38.46,12.5 38.96,12 41.46,12 41.96,11.5 55.21,11.5 v55.46,11.75 | 57.46,8 v55.71,9.75
C0  (via drill 0.35)
  Top 0.254: XC95CPLD.1 60.96,31.75 60.96,41.5 61.46,42 v61.46,42.25
  Bottom 0.254: v61.46,42.25 61.46,44.25 60.96,44.25 U1.JP7_6
C1
  Top 0.254: XC95CPLD.44 62.71,33.5 62.71,43.5 63.46,44.25 U1.JP7_5
C2
  Top 0.254: XC95CPLD.43 64.96,30.5 65.46,31 65.46,32 65.96,32.5 65.96,44.25 U1.JP7_4
C3  (via drill 0.35)
  Top 0.254: v66.96,35.25 68.46,36.75 68.46,44.25 U1.JP7_3
  Bottom 0.254: v66.96,35.25 64.96,33.25 XC95CPLD.42
C4
  Top 0.254: XC95CPLD.40 67.46,33.25 69.46,35.25 69.46,42.75 70.96,44.25 U1.JP7_2
CLK  (via drill 0.35)
  Top 0.254: v60.46,42 60.46,34 59.71,33.25 XC95CPLD.2
  Bottom 0.254: v60.46,42 58.21,44.25 U1.JP7_7
D0  (via drill 0.35)
  Top 0.254: 4A.1 39.21,5.25 v39.21,19.75 39.46,20 39.46,74.75 4A1.1
  Bottom 0.254: v39.21,19.75 49.21,19.75 50.96,21.5 52.46,21.5 52.96,22 53.71,22 54.46,22.75 XC95CPLD.14
D1  (via drill 0.35)
  Top 0.254: 41.96,11.5 v45.21,14.75 | 41.96,11.5 41.96,5.25 5A.1 | 41.96,11.5 41.96,74.75 5A1.1
  Bottom 0.254: v45.21,14.75 54.21,14.75 54.46,15 XC95CPLD.18
D2  (via drill 0.35)
  Top 0.254: 6A.1 44.46,5.25 44.46,13 v47.96,16.5 43.96,20.5 43.96,32.25 44.46,32.75 44.46,74.75 6A1.1
  Bottom 0.254: v47.96,16.5 52.46,16.5 53.21,17.25 53.96,17.25 54.46,17.75 XC95CPLD.19
D3  (via drill 0.35)
  Top 0.254: v60.96,12.5 60.96,16.5 62.21,17.75 XC95CPLD.25 | 9A.1 52.21,5.25 52.21,12 v52.71,12.5 50.46,14.75 50.46,21.5 v50.21,21.75 | v49.46,60.75 51.46,62.75 51.46,74.25 51.96,74.75 9A1.1 | v38.21,52.25 38.46,52 38.46,25 v38.21,24.75
  Bottom 0.254: v52.71,12.5 v60.96,12.5 | v49.46,60.75 49.21,61 41.96,61 38.71,57.75 38.71,52.25 v38.21,52.25 | v38.21,24.75 41.21,21.75 v50.21,21.75
D4  (via drill 0.35)
  Top 0.254: 10A.1 54.71,5.25 54.71,12 v55.96,13.25 55.96,39.25 59.71,43 59.71,60.25 54.71,65.25 54.71,74.75 10A1.1
  Bottom 0.254: v55.96,13.25 62.96,13.25 64.71,15 XC95CPLD.26
D5  (via drill 0.35)
  Top 0.254: v53.96,16.5 53.46,16.5 53.21,16.75 52.71,16.75 52.46,16.5 50.96,16.5 50.96,22 50.46,22.5 49.46,22.5 | 49.46,22.5 49.46,5.25 8A.1 | 49.46,22.5 49.46,31 46.96,33.5 46.96,60.25 48.71,62 48.71,74 49.46,74.75 8A1.1
  Bottom 0.254: v53.96,16.5 60.96,16.5 62.21,15.25 XC95CPLD.24
D6  (via drill 0.35)
  Top 0.254: 7A.1 46.96,5.25 46.96,12.5 v48.46,14 48.71,14.25 48.71,31 v46.21,33.5 | v46.71,63.75 46.71,74.5 46.96,74.75 7A1.1 | v35.46,49.5 37.71,47.25 v37.71,42
  Bottom 0.254: v48.46,14 55.96,14 56.96,15 XC95CPLD.20 | v46.71,63.75 44.96,62 39.46,62 34.96,57.5 34.96,49.5 v35.46,49.5 | v46.21,33.5 v37.71,42
D7
  Top 0.254: 1A.1 31.96,5.25 32.21,5.5 32.21,48.5 33.21,49.5 33.21,68.25 31.96,69.5 31.96,74.75 1A1.1
GND  (via drill 0.35)
  Top 0.4: 11.09,69.38 10.96,69.25 8.96,69.25 8.96,62.25 7.71,61 J1.8 | 11.09,69.38 16.46,74.75 JP5.2 | 15.21,45 15.21,45.5 IC3.1 | 15.21,45 15.21,43.25 IC3.2 15.21,43 15.21,40.75 IC3.3 15.46,40.5 16.96,39 16.96,29.5 15.46,28 IC3.8 | 15.21,45 24.46,54.25 S1.1 24.46,54.5 15.21,63.75 15.21,65.25 11.09,69.38 | v31.21,69.75 31.21,54.5 S1.2 | 53.21,48.5 53.21,44.5 U1.JP7_9 | 53.21,48.5 53.21,54.75 48.46,59.5 U1.JP6_2 | v85.96,27.5 v85.96,20.5 85.96,15.25 86.46,14.75 IC1.1 | U1.JP1_6 43.21,45.75 43.21,48.25 U1.JP1_5 | v58.96,24.75 v58.96,21.5 58.96,18.5 59.46,18 XC95CPLD.23 | v37.71,6.75 37.71,14.5 37.96,14.75 37.96,21.75 36.96,22.75 DIS0.1 | v47.71,48.5 53.21,48.5
  Bottom 0.4: 5B1.1 41.71,75 39.46,75 4B1.1 39.21,74.75 39.21,69.75 v31.21,69.75 | S1.1 24.71,54.5 30.96,54.5 S1.2 | 5B.1 41.71,5.25 39.46,5.25 4B.1 39.21,5.25 v37.71,6.75 | v85.96,27.5 86.21,27.75 89.96,27.75 JP3.2 | 36.96,25.5 36.96,23 DIS0.1 | 36.96,25.5 50.46,25.5 51.71,26.75 53.46,26.75 54.46,27.75 XC95CPLD.10 54.71,27.75 55.96,27.75 v58.96,24.75 | v58.96,21.5 68.71,21.5 69.71,20.5 XC95CPLD.31 69.96,20.5 v85.96,20.5 | U1.JP1_6 42.21,44.75 39.21,44.75 36.96,42.5 36.96,29 | 36.96,25.5 36.96,29 | v47.71,48.5 43.21,48.5 U1.JP1_5 | 36.96,29 16.46,29 15.46,28 IC3.8
  pour Bottom (isolate 0.2): 0,78.74 93.98,78.74 93.98,0 0,0
  pour Top (isolate 0.2): 0,78.74 93.98,78.74 93.98,0 0,0
N$1  (via drill 0.35)
  Top 0.254: v50.46,27 51.96,25.5 XC95CPLD.11
  Bottom 0.254: v50.46,27 49.71,27.75 43.96,27.75 43.96,30 JP6.3
N$2  (via drill 0.35)
  Top 0.254: v50.21,28.25 51.96,26.5 54.46,26.5 54.46,25.5 XC95CPLD.12
  Bottom 0.254: v50.21,28.25 46.71,28.25 45.96,29 JP6.2
N$3  (via drill 0.35)
  Top 0.254: v47.96,24.5 45.96,26.5 JP6.1
  Bottom 0.254: v47.96,24.5 49.46,23 51.96,23 XC95CPLD.13
N$5  (via drill 0.35)
  Top 0.4: v35.96,53.25 34.96,54.25 34.96,55.25 36.71,57 JP2.2
  Bottom 0.4: v35.96,53.25 38.21,51 42.96,51 U1.JP1_4 43.21,51 44.71,51 53.21,59.5 U1.JP6_4
N$20  (via drill 0.35)
  Top 0.254: v28.46,21 28.46,41.25 26.71,43 R8.1
  Bottom 0.254: IC3.15 22.96,43.25 26.46,43.25 R8.1 26.71,43.25 30.96,47.5 34.46,47.5 36.46,49.5 49.71,49.5 56.96,56.75 U1.JP2_1 | v28.46,21 30.96,21 36.71,15.25 DIS0.4
N$21  (via drill 0.35)
  Top 0.254: v27.71,27 27.71,39.5 26.71,40.5 R7.1
  Bottom 0.254: IC3.14 22.96,40.75 26.46,40.75 R7.1 26.71,40.75 32.96,47 43.71,47 43.96,47.25 48.21,47.25 52.21,51.25 58.46,51.25 58.46,57.25 57.71,58 55.71,58 54.71,57 U1.JP2_2 | v27.71,27 36.71,18 DIS0.3
N$29
  Top 0.254: J1.1 10.46,67.75 13.46,64.75 13.46,40 15.21,38.25 IC3.4
  Bottom 0.254: R1.2 10.21,38.25 15.21,38.25 IC3.4
N$32
  Top 0.254: J1.2 10.46,65 12.96,62.5 12.96,38 15.21,35.75 IC3.5
  Bottom 0.254: R2.2 10.21,35.75 15.21,35.75 IC3.5
N$33
  Top 0.254: 12.21,33 15.21,33 IC3.6 | 12.21,33 10.21,33 R3.2 | 12.21,33 12.21,60.25 10.46,62 J1.3
N$34
  Top 0.254: IC3.7 15.21,30.5 10.21,30.5 R4.2 9.96,30.5 9.21,31.25 9.21,38.5 11.71,41 11.71,58 10.46,59.25 J1.4
N$35
  Bottom 0.254: R5.2 26.46,30.5 22.96,30.5 IC3.10 22.71,30.5 21.71,31.5 1.46,31.5 1.46,33.5 1.96,34 3.71,34 3.71,62.5 7.46,66.25 J1.6
N$36
  Top 0.254: IC3.9 22.71,27.75 16.96,27.75 16.96,27.5 16.46,27 5.96,27 5.96,52.25 10.21,56.5 J1.5
N$37
  Top 0.254: IC3.12 22.96,35.75 24.71,37.5 24.71,49.75 S1.3
  Bottom 0.254: IC3.12 22.96,35.75 26.46,35.75 R6.2 | S1.3 24.71,50 30.96,50 S1.4
N$38
  Bottom 0.254: JP1.2 18.96,64.75 17.21,63 11.46,63 10.96,63.5 7.71,63.5 J1.7
N$39  (via drill 0.35)
  Top 0.254: v21.21,48.75 21.21,34.75 22.71,33.25 IC3.11
  Bottom 0.254: v21.21,48.75 11.96,58 7.71,58 J1.9
NRST
  Bottom 0.254: XC95CPLD.3 59.46,30.5 59.46,31.75 59.21,31.75 58.46,32.5 58.46,39.75 55.96,42.25 55.96,44.25 U1.JP7_8
SPARE1  (via drill 0.35)
  Top 0.254: v58.96,40.25 58.96,35 57.21,33.25 XC95CPLD.4
  Bottom 0.254: v58.96,40.25 59.96,41.25 72.21,41.25 74.96,44 74.96,56.75 67.46,56.75 U1.JP3_1
SPARE2
  Bottom 0.254: XC95CPLD.9 51.96,28 46.96,33 46.96,40.75 42.46,40.75 39.96,43.25 39.96,44.25 43.71,44.25 46.21,46.75 54.71,46.75 61.71,53.75 61.71,56.75 64.71,56.75 U1.JP3_2
SPARE3  (via drill 0.35)
  Top 0.254: v62.21,28.75 63.46,30 v63.46,42.75
  Bottom 0.254: v62.21,28.75 56.21,28.75 54.71,30.25 XC95CPLD.8 | v63.46,42.75 62.21,44 62.21,55.5 65.46,55.5 66.21,56.25 66.21,58.25 64.96,58.25 63.71,59.5 U1.JP6_8
SPARE4  (via drill 0.35)
  Top 0.254: v49.96,42 49.96,30.5 51.96,30.5 XC95CPLD.7 | v60.46,46.25 60.96,46.75 U1.JP6_7
  Bottom 0.254: v49.96,42 48.96,43 47.96,43 46.96,44 46.96,46.25 v60.46,46.25
SPARE5
  Bottom 0.254: XC95CPLD.6 54.71,33 54.71,31.75 54.96,31.75 55.96,30.75 55.96,29.75 56.21,29.75 56.71,29.25 60.21,29.25 60.96,30 60.96,40.75 72.46,40.75 75.46,43.75 75.46,61 59.71,61 58.46,59.75 U1.JP6_6
SPARE6  (via drill 0.35)
  Top 0.254: v40.71,43.5 40.96,43.75 40.96,61 v40.71,61.25
  Bottom 0.254: v40.71,43.5 42.96,41.25 55.71,41.25 55.71,31.75 56.96,30.5 XC95CPLD.5 | v40.71,61.25 40.96,61.5 53.96,61.5 55.71,59.75 U1.JP6_5
TCK  (via drill 0.35)
  Top 0.254: v53.71,24 53.21,23.5 53.21,19 52.21,18 XC95CPLD.17
  Bottom 0.254: v53.71,24 63.46,24 63.46,33.25 66.21,36 70.96,36 71.71,36.75 91.96,36.75 91.96,32.25 90.21,30.5 JP4.1
TDI
  Bottom 0.254: JP4.3 89.96,35.5 87.46,33 68.96,33 67.71,31.75 66.96,31.75 65.96,30.75 65.96,22.25 55.71,22.25 54.96,21.5 53.21,21.5 52.21,20.5 XC95CPLD.15
TDO
  Bottom 0.254: JP4.2 89.96,33 88.46,31.5 88.46,29 91.21,29 91.96,28.25 91.96,24.25 89.46,24.25 88.96,23.75 88.96,18 89.21,17.75 89.21,16.75 70.46,16.75 70.21,16.5 68.71,16.5 67.46,17.75 XC95CPLD.30
TMS  (via drill 0.35)
  Top 0.254: v70.71,37.75 69.96,37 69.96,34 67.71,31.75 65.96,31.75 65.96,29 59.71,22.75 v59.71,20.75
  Bottom 0.254: v70.71,37.75 89.71,37.75 89.96,38 JP4.4 | v59.71,20.75 59.46,20.5 54.71,20.5 XC95CPLD.16
VCC  (via drill 0.35)
  Top 0.4: v88.46,17.5 91.21,14.75 IC1.3 | JP1.1 16.71,65 18.96,67.25 18.96,74.75 JP5.1 | R4.1 2.46,30.5 2.46,33 R3.1 2.46,33.25 2.46,35.5 R2.1 2.46,35.75 2.46,38 R1.1 | R6.1 34.21,35.5 34.21,30.5 R5.1 34.46,30.25 34.71,30 34.71,22.5 36.71,20.5 DIS0.2 | R7.2 34.21,40.75 34.21,43 R8.2 34.46,43.25 34.71,43.5 34.71,50 36.71,52 36.71,54.5 JP2.1
  Bottom 0.4: v88.46,17.5 86.96,19 38.21,19 36.96,20.25 DIS0.2 | JP5.1 19.21,75 31.71,75 1B1.1 | 20.96,39.5 20.96,43.75 22.71,45.5 IC3.16 22.71,45.75 22.71,48.5 21.71,49.5 21.46,49.5 21.46,64.75 19.46,66.75 18.46,66.75 16.71,65 JP1.1 | 20.96,39.5 33.21,39.5 33.34,39.62 | 33.34,39.62 34.21,40.5 R7.2 | R6.1 34.21,35.75 34.21,39.5 33.46,39.5 33.34,39.62 | 20.96,39.5 9.96,39.5 3.96,33.5 2.96,33.5 2.71,33.25 R3.1 | 1B.1 31.71,5.25 6.71,30.25 2.71,30.25 R4.1

### Text on the board
tNames: 5V | GND | TMS | TDI | TDO | TCK | GND | VREF | ZX81 KBD+ / (C) 2023 Alejandro Valero / (Wilco2009) / Thanks to Wilf Rigter